# Altium schematic sheet Battery_Operated Node.SchDoc: Battery Oprated node
size OrCAD B; Date: 3/26/2015 6:39:54 PM; ApprovedBy: Approved By:; CheckedBy: Checked By:; Author: Auther:; CompanyName: Souliss; DrawnBy: Yoosof Piran; Engineer: Yoosof Piran; Revision: None; SheetNumber: 1; Design by:: Design by:Yoosof Piran; ProjectName: Battery Operated Nodes
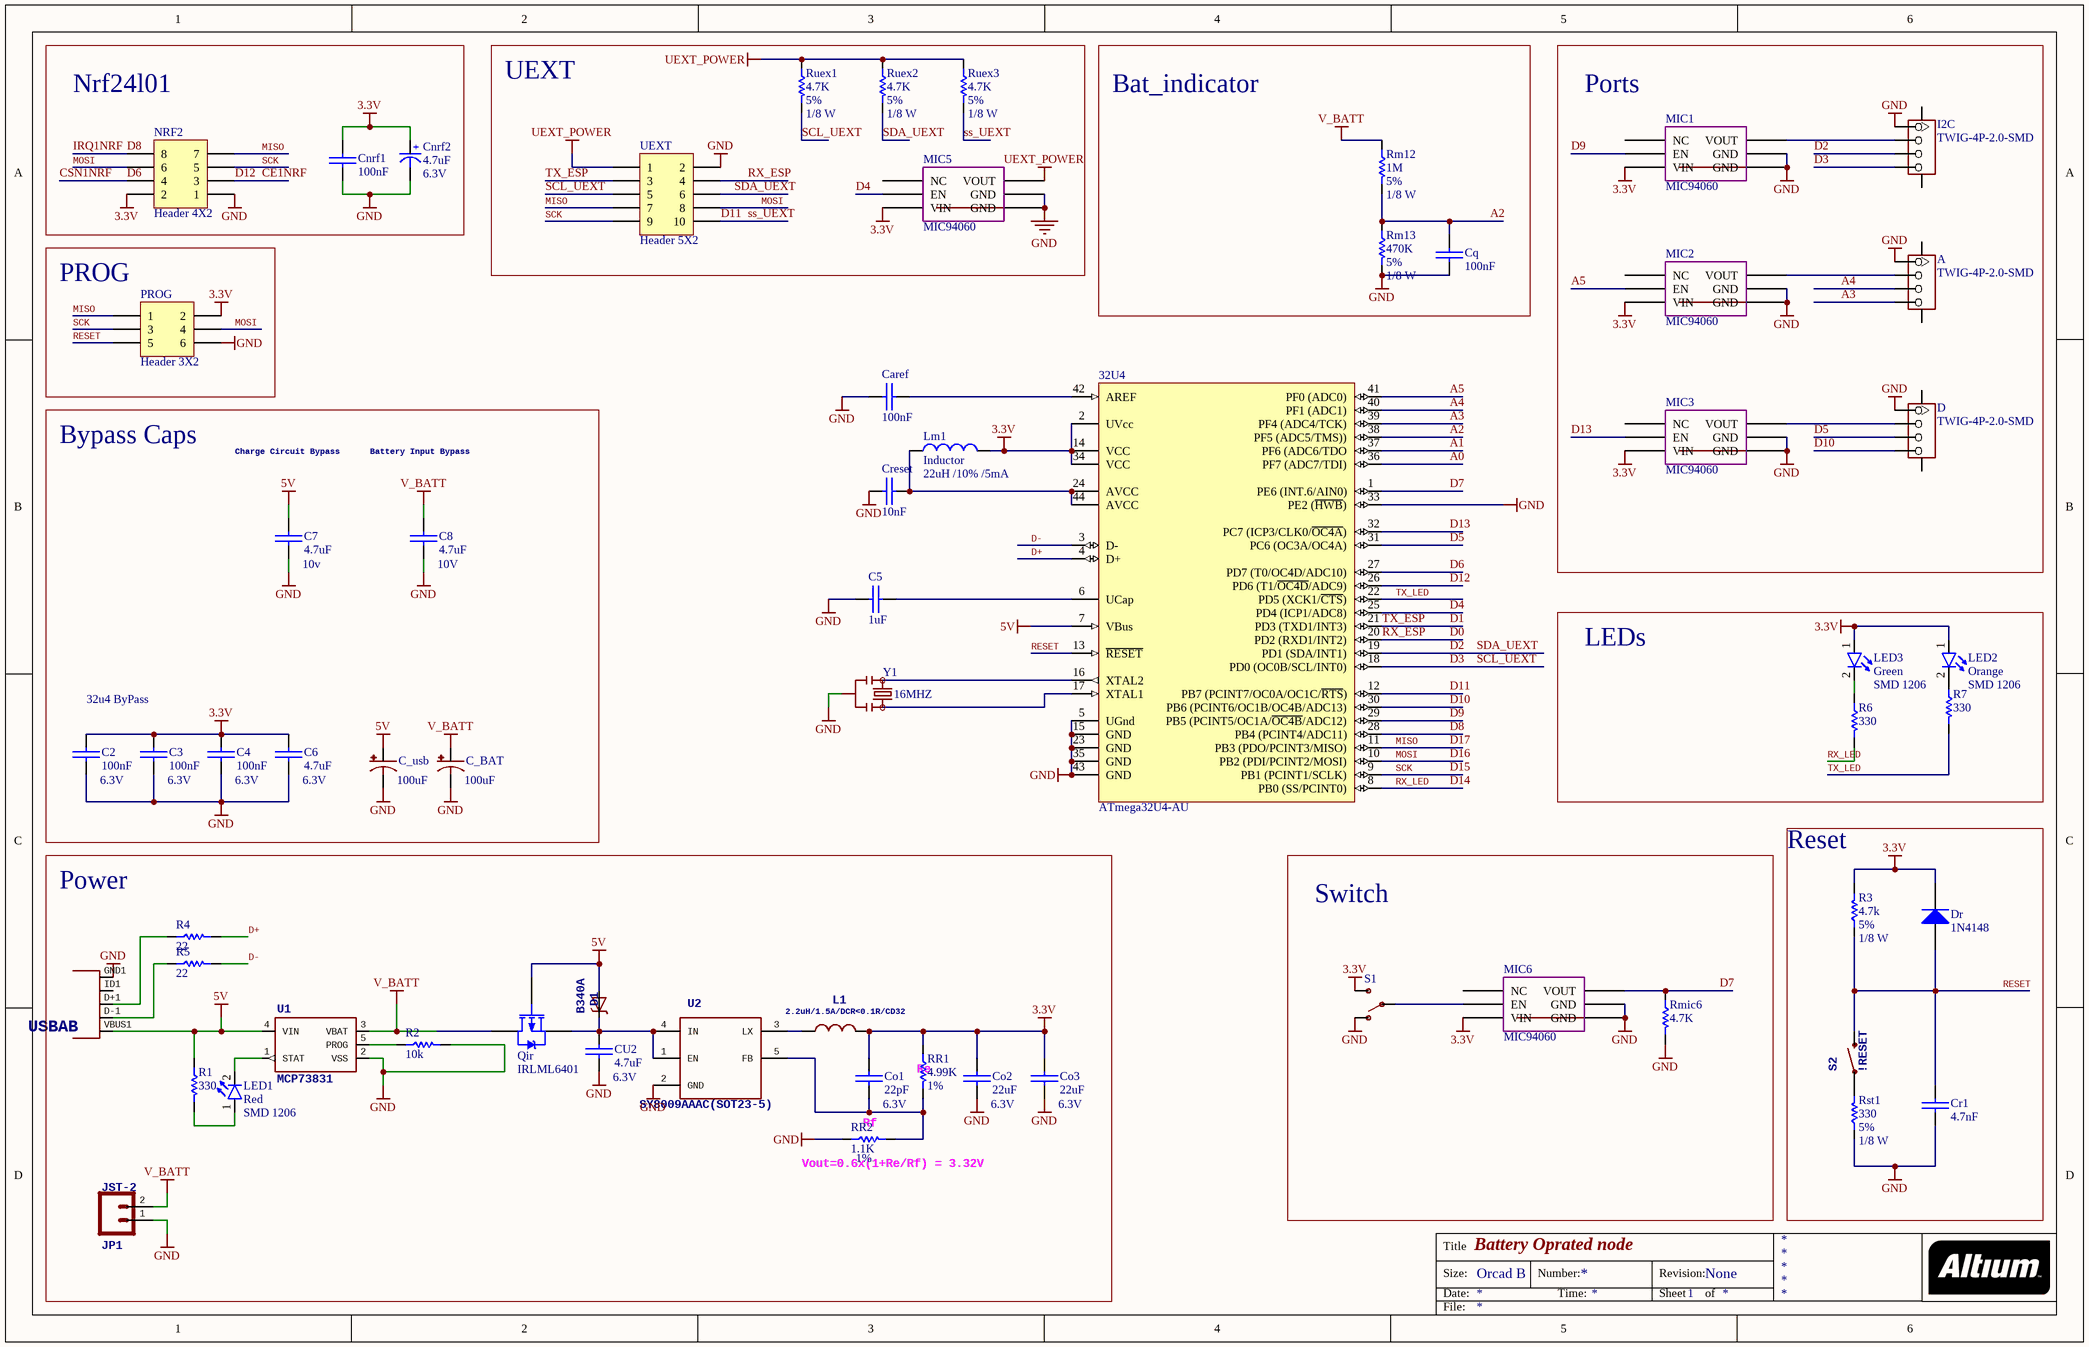
[diagram p0: Battery_Operated Node.SchDoc]

## Parts
32U4  ATmega32U4-AU  [44ML_N]
A  TWIG-4P-2.0-SMD  [4P-SMD-2.0]
C2  Voltage: 6.3V  [SMD_CAP_0805]  (hidden comment: 100nF)
C3  Voltage: 6.3V  [SMD_CAP_0805]  (hidden comment: 100nF)
C4  Voltage: 6.3V  [SMD_CAP_0805]  (hidden comment: 100nF)
C5  1uF  [SMD_CAP_0805]
C6  Voltage: 6.3V  [SMD_CAP_0805]  (hidden comment: 4.7uF)
C7  Voltage: 10v  [SMD_CAP_0805]  (hidden comment: 4.7uF)
C8  Voltage: 10V  [SMD_CAP_0805]  (hidden comment: 4.7uF)
C_BAT  value 100uF  [PANASONIC_D]  (hidden comment: Polar Capacitor 10V)
C_usb  value 100uF  [PANASONIC_D]  (hidden comment: Polar Capacitor 10V)
Caref  100nF  [SMD_CAP_0805]
Cnrf1  100nF  [SMD_CAP_0805]
Cnrf2  value 4.7uF  Voltage: 6.3V  [CAPP 1206 (3216X18L) Size A]  (hidden comment: 4.7uF 6.3V Tantalum)
Co1  Voltage: 6.3V  [SMD_CAP_0805]  (hidden comment: 22pF)
Co2  Voltage: 6.3V  [SMD_CAP_0805]  (hidden comment: 22uF)
Co3  Voltage: 6.3V  [SMD_CAP_0805]  (hidden comment: 22uF)
Cq  100nF  [SMD_CAP_0805]
Cr1  4.7nF  [SMD_CAP_0805]
Creset  10nF  [SMD_CAP_0805]
CU2  Voltage: 6.3V  [SMD_CAP_0805]  (hidden comment: 4.7uF)
D  TWIG-4P-2.0-SMD  [4P-SMD-2.0]
D1  B340A  [SMA-DIODE]
Dr  1N4148  [LL4148]
I2C  TWIG-4P-2.0-SMD  [4P-SMD-2.0]
JP1  JST-2  [JST-2-SMD]
L1  2.2uH/1.5A/DCR<0.1R/CD32  [CD32]
LED1  Size: SMD 1206  [LED SMD 1206]  (hidden comment: Red)
LED2  Size: SMD 1206  [LED SMD 1206]  (hidden comment: Orange)
LED3  Size: SMD 1206  [LED SMD 1206]  (hidden comment: Green)
Lm1  Inductor  value 22uH /10% /5mA  [INDC3216]
MIC1  MIC94060  [mic94060]
MIC2  MIC94060  [mic94060]
MIC3  MIC94060  [mic94060]
MIC5  MIC94060  [mic94060]
MIC6  MIC94060  [mic94060]
NRF2  Header 4X2  [HDR2X4]
PROG  Header 3X2  [HDR2X3]
Qir  IRLML6401  [Micro3_N]
R1  330  [RES 0805 (2012X06L)]
R2  10k  [RES 0805 (2012X06L)]
R3  Tolerance: 5%  Power: 1/8 W  [RES 0805 (2012X06L)]  (hidden comment: 4.7k)
R4  22  [RES 0805 (2012X06L)]
R5  22  [RES 0805 (2012X06L)]
R6  330  [RES 0805 (2012X06L)]
R7  330  [RES 0805 (2012X06L)]
Rm12  Tolerance: 5%  Power: 1/8 W  [RES 0805 (2012X06L)]  (hidden comment: 1M)
Rm13  Tolerance: 5%  Power: 1/8 W  [RES 0805 (2012X06L)]  (hidden comment: 470K)
Rmic6  4.7K  [RES 0805 (2012X06L)]
RR1  Tolerance: 1%  [RES 0805 (2012X06L)]  (hidden comment: 4.99K)
RR2  Tolerance: 1%  [RES 0805 (2012X06L)]  (hidden comment: 1.1K)
Rst1  Tolerance: 5%  Power: 1/8 W  [RES 0805 (2012X06L)]  (hidden comment: 330)
Ruex1  Tolerance: 5%  Power: 1/8 W  [RES 0805 (2012X06L)]  (hidden comment: 4.7K)
Ruex2  Tolerance: 5%  Power: 1/8 W  [RES 0805 (2012X06L)]  (hidden comment: 4.7K)
Ruex3  Tolerance: 5%  Power: 1/8 W  [RES 0805 (2012X06L)]  (hidden comment: 4.7K)
S1  (no value)  [SWITCH-SPDT-SMD]
S2  !RESET  [TACTILE_SWITCH_SMD]
U1  MCP73831  [SOT23-5]
U2  SY8009AAAC(SOT23-5)  [SOT23-5]
U5  USB AB Connector(micro usb)  [USB-AB-MICRO-SMD_V03]  (value not drawn)
UEXT  Header 5X2  [HDR2X5]
Y1  16MHZ  [RESONATOR-SMD]

## Blocks framed on the sheet
Nrf24l01: Cnrf1 Cnrf2 NRF2
UEXT: MIC5 Ruex1-Ruex3 UEXT
Bat_indicator: Cq Rm12 Rm13
Ports: A D I2C MIC1-MIC3
PROG: PROG
Bypass Caps: C2-C4 C6-C8 C_BAT C_usb
LEDs: LED2 LED3 R6 R7
Reset: Cr1 Dr R3 Rst1 S2
Power: Co1-Co3 CU2 D1 JP1 L1 LED1 Qir R1 R2 R4 R5 RR1 RR2 U1 U2 U5
Switch: MIC6 Rmic6 S1

## Nets
3.3V: 32U4.2(UVcc) 32U4.14(VCC) 32U4.34(VCC) C2.2(-) C3.2(-) C4.2(-) C6.2(-) Cnrf1.1(+) Cnrf2.1(+) Co1.2(-) Co2.2(-) Co3.2(-) Dr.2(K) L1.2 LED2.1(A) LED3.1(A) Lm1.2 MIC1.4(VIN) MIC2.4(VIN) MIC3.4(VIN) MIC5.4(VIN) MIC6.4(VIN) NRF2.2 PROG.2 R3.2 RR1.1 S1.3(S)
5V: 32U4.7(VBus) C7.2(-) C_usb.+ D1.A Qir.1(G) R1.1 U1.4(VIN) U5.VBUS1(VBUS)
GND: 32U4.5(UGnd) 32U4.15(GND) 32U4.23(GND) 32U4.33(PE2_(~{HWB})) 32U4.35(GND) 32U4.43(GND) A.1 C2.1(+) C3.1(+) C4.1(+) C5.1(+) C6.1(+) C7.1(+) C8.1(+) C_BAT.- C_usb.- Caref.1(+) Cnrf1.2(-) Cnrf2.2(-) Co2.1(+) Co3.1(+) Cq.2(-) Cr1.2(-) Creset.1(+) CU2.1(+) D.1 I2C.1 JP1.1 MIC1.2(GND) MIC1.5(GND) MIC2.2(GND) MIC2.5(GND) MIC3.2(GND) MIC3.5(GND) MIC5.2(GND) MIC5.5(GND) MIC6.2(GND) MIC6.5(GND) NRF2.1 PROG.6 R2.2 Rm13.2 Rmic6.2 RR2.1 Rst1.1 S1.1(O) U1.2(VSS) U2.2(GND) U5.GND1(GND) UEXT.2 Y1.2
UEXT_POWER: MIC5.1(VOUT) Ruex1.1 Ruex2.1 Ruex3.1 UEXT.1
V_BATT: C8.2(-) C_BAT.+ JP1.2 Qir.3(D) Rm12.1 U1.3(VBAT)
A0: 32U4.36(PF7_(ADC7/TDI))
A1: 32U4.37(PF6_(ADC6/TDO)
A2: 32U4.38(PF5_(ADC5/TMS))) Cq.1(+) Rm12.2 Rm13.1
A3: 32U4.39(PF4_(ADC4/TCK)) A.4
A4: 32U4.40(PF1_(ADC1)) A.3
A5: 32U4.41(PF0_(ADC0)) MIC2.3(EN)
CE1NRF: 32U4.26(PD6_(T1/~{OC4D}/ADC9)) NRF2.3  [also labelled D12]
CSN1NRF: 32U4.27(PD7_(T0/OC4D/ADC10)) NRF2.4  [also labelled D6]
D0: 32U4.20(PD2_(RXD1/INT2)) UEXT.4  [also labelled RX_ESP]
D1: 32U4.21(PD3_(TXD1/INT3)) UEXT.3  [also labelled TX_ESP]
D2: 32U4.19(PD1_(SDA/INT1)) I2C.3 Ruex2.2 UEXT.6  [also labelled SDA_UEXT]
D3: 32U4.18(PD0_(OC0B/SCL/INT0)) I2C.4 Ruex1.2 UEXT.5  [also labelled SCL_UEXT]
D4: 32U4.25(PD4_(ICP1/ADC8)) MIC5.3(EN)
D5: 32U4.31(PC6_(OC3A/OC4A)) D.3
D7: 32U4.1(PE6_(INT.6/AIN0)) MIC6.1(VOUT) Rmic6.1
D8: 32U4.28(PB4_(PCINT4/ADC11)) NRF2.8  [also labelled IRQ1NRF]
D9: 32U4.29(PB5_(PCINT5/OC1A/~{OC4B}/ADC12)) MIC1.3(EN)
D10: 32U4.30(PB6_(PCINT6/OC1B/OC4B/ADC13)) D.4
D11: 32U4.12(PB7_(PCINT7/OC0A/OC1C/~{RTS})) Ruex3.2 UEXT.10  [also labelled ss_UEXT]
D13: 32U4.32(PC7_(ICP3/CLK0/~{OC4A})) MIC3.3(EN)
D14: 32U4.8(PB0_(SS/PCINT0)) R6.2  [also labelled RX_LED]
D15: 32U4.9(PB1_(PCINT1/SCLK)) NRF2.5 PROG.3 UEXT.9  [also labelled SCK]
D16: 32U4.10(PB2_(PDI/PCINT2/MOSI)) NRF2.6 PROG.4 UEXT.8  [also labelled MOSI]
D17: 32U4.11(PB3_(PDO/PCINT3/MISO)) NRF2.7 PROG.1 UEXT.7  [also labelled MISO]
D+: 32U4.4(D+) R4.2
D-: 32U4.3(D-) R5.2
RESET: 32U4.13(~{RESET}) Cr1.1(+) Dr.1(A) PROG.5 R3.1 S2.3
TX_LED: 32U4.22(PD5_(XCK1/~{CTS})) R7.2
Net32U4_6: 32U4.6(UCap) C5.2(-)
Net32U4_16: 32U4.16(XTAL2) Y1.1
Net32U4_17: 32U4.17(XTAL1) Y1.3
Net32U4_24: 32U4.24(AVCC) 32U4.44(AVCC) Creset.2(-) Lm1.1
Net32U4_42: 32U4.42(AREF) Caref.2(-)
NetA_2: A.2 MIC2.1(VOUT)
NetCo1_1: Co1.1(+) RR1.2 RR2.2 U2.5(FB)
NetCU2_2: CU2.2(-) D1.C Qir.2(S) U2.1(EN) U2.4(IN)
NetD_2: D.2 MIC3.1(VOUT)
NetI2C_2: I2C.2 MIC1.1(VOUT)
NetL1_1: L1.1 U2.3(LX)
NetLED1_1: LED1.1(A) R1.2
NetLED1_2: LED1.2(K) U1.1(STAT)
NetLED2_2: LED2.2(K) R7.1
NetLED3_2: LED3.2(K) R6.1
NetMIC6_3: MIC6.3(EN) S1.2(P)
NetR2_1: R2.1 U1.5(PROG)
NetR4_1: R4.1 U5.D+1(D+)
NetR5_1: R5.1 U5.D-1(D-)
NetRst1_2: Rst1.2 S2.1

Not connected (* = marked no-connect by the designer): A SS1 SS2; D SS1 SS2; I2C SS1 SS2; MIC1 6(NC); MIC2 6(NC); MIC3 6(NC); MIC5 6(NC); MIC6 6(NC); U5 ID1(USBID)

## Notes on the sheet
- Charge Circuit Bypass
- Battery Input Bypass
- 32u4 ByPass
- (near RR1) Re
- (near RR2) Vout=0.6x(1+Re/Rf) = 3.32V
- (near RR2) Rf
- Title
- Size:
- Date:
- Orcad B
- Number:
- Time:
- Revision:
- Sheet
- of
- File:

## Library data of the parts
32U4 = ATmega32U4-AU: 8-bit AVR Microcontroller, 44-pin TQFP, Industrial Grade (-40°C to 85°C); Published: 1-Apr-2010; DatasheetVersion: revD, Jan-2009; PackageVersion: rev.G, Jul-2007; PackageReference: 44ML; Publisher: Altium Limited; PackageDescription: 44-Pin Plastic Thin Quad Flat Pack, 10 x 10 x 1.0 mm Body, 0.8 mm Pitch (TQFP); Supplier 1: Digi-Key; Supplier Part Number 1: ATMEGA32U4-AU-ND; Supplier 2: Farnell; Supplier Part Number 2: 1748525; Supplier 3: Mouser; Supplier Part Number 3: 556-ATMEGA32U4-AU; ComponentLink1Description: Manufacturer Link; ComponentLink1URL: http://www.atmel.com/products/avr/default.asp?; ComponentLink2Description: ATmega16U4/32U4 Datasheet; ComponentLink2URL: http://www.atmel.com/dyn/resources/prod_documents/doc7766.pdf; ComponentLink3Description: ATmega16U4 ATmega32U4 Summary; ComponentLink3URL: http://www.atmel.com/dyn/resources/prod_documents/7766S.pdf; ComponentLink4Description: Atmel.com Home; ComponentLink4URL: http://www.atmel.com
A D I2C = TWIG-4P-2.0-SMD-FEMALE-REINFORCE'DD': part num:1125S-SMT-4P URL: http://oom.lt/J204S
C2-C4 C6-C8 Co1-Co3 CU2 = Cap-Bipolar: ceramic capacitor
  C2-C4: Value: 100nF
  C6-C8 CU2: Value: 4.7uF
  Co1: Value: 22pF
  Co2 Co3: Value: 22uF
C5 Cq = Cap-Bipolar: ceramic capacitor; Voltage: 6.3V
  C5: Value: 1uF
  Cq: Value: 100nF
C_BAT C_usb = CAP_POLD
Caref Cnrf1 Cr1 Creset = Cap-Bipolar: ceramic capacitor; Voltage: 100V; Designer: Saeid Jorablo; Organazation: ControTec; Adding Date: 1387/12/20
  Caref Cnrf1: Value: 100nF
  Cr1: Value: 4.7nF
  Creset: Value: 10nF
Cnrf2 = Cap-Polar: Tantalum Capacitor Size A
D1 = DIODE-SCHOTTKY-B340A: Schottky diodes in SFE's production catalog<p> / BAT20J 1A 23V 0.62Vf<br> / RB751 120mA 40V 0.37Vf<br> / PMEG4005EJ 0.5A 40V 0.42Vf<br> / MBRA140 1A 40V 0.5Vf<br> / B340A  3A 40V SMA <br>
Dr = Diode 1N4148: High Conductance Fast Diode; Published: 8-Jun-2000; LatestRevisionDate: 17-Jul-2002; LatestRevisionNote: Re-released for DXP Platform.; DatasheetVersion: 1997; PackageReference: DO-35; Publisher: Altium Limited; PackageDescription: Diode, Axial; Body 3.8 x 1.9 mm (LxDia. max), Lead Dia. 0.53 mm (max); Code_JEDEC: DO-204-AH; ComponentLink1Description: Manufacturer Link; ComponentLink1URL: http://www.fairchildsemi.com/; ComponentLink2Description: Datasheet; ComponentLink2URL: http://www.fairchildsemi.com/ds/1N%2F1N4148.pdf
JP1 = M02-JST-2MM-SMT: Standard 2-pin 0.1" header. Use with <br> / - straight break away headers ( PRT-00116)<br> / - right angle break away headers (PRT-00553)<br> / - swiss pins (PRT-00743)<br> / - machine pins (PRT-00117)<br> / - female headers (PRT-00115)<br><br> / Molex polarized connector foot print use with: PRT-08233 with associated crimp pins and housings.<br><br> / 2.54_SCREWTERM for use with  PRT-10571.<br><br> / 3.5mm Screw Terminal footprints for  PRT-08084<br><br> / 5mm Screw Terminal footprints for use with PRT-08433; PROD_ID: CONN-08352
L1 = L-CD32
LED1-LED3 = LED: Designer: Saeid Jorablo; Organazation: ControTec; Adding Date: 1387/12/22
  LED1: Color: Red
  LED2: Color: Orange
  LED3: Color: Green
Lm1 = Inductor: Code_IEC: 1005; Published: 8-Jun-2000; LatestRevisionDate: 29-May-2009; LatestRevisionNote: IPC-7351 Footprint Added.; PackageReference: 0402-A; Publisher: Altium Limited; PackageDescription: Chip Inductor; Code_JEITA: 0402
MIC1-MIC3 MIC5 MIC6 = MIC94060: MIC94060YC6, SC-70-6
NRF2 = Header 4X2: Header, 4-Pin, Dual row; Revision: 17-Jul-2002: Re-released for DXP Platform.; Publisher: Altium Limited
PROG = Header 3X2: Header, 3-Pin, Dual row; Revision: 17-Jul-2002: Re-released for DXP Platform.; Publisher: Altium Limited
Qir = IRLML6401: HEXFET Power MOSFET; Published: 17-Sep-2003; DatasheetVersion: 2-Jul-2001; PackageVersion: Jul-2001; PackageReference: Micro3; Publisher: Altium Limited; PackageDescription: 3-Pin SOT-23 Package 0.95 mm Pitch, 2.3 mm Lead Span; ComponentLink1Description: Manufacturer Link; ComponentLink1URL: http://www.irf.com/; ComponentLink2Description: Datasheet; ComponentLink2URL: http://www.irf.com/product-info/datasheets/data/IRLML6401.pdf
R1 R2 R4-R7 Rmic6 = Resistor: Tolerance: 5%; Power: 1/8 W
  R1 R6 R7: Value: 330
  R2: Value: 10k
  R4 R5: Value: 22
  Rmic6: Value: 4.7K
R3 Rm12 Rm13 Rst1 Ruex1-Ruex3 = Resistor
  R3: Value: 4.7k
  Rm12: Value: 1M
  Rm13: Value: 470K
  Rst1: Value: 330
  Ruex1-Ruex3: Value: 4.7K
RR1 RR2 = Resistor: Power: 1/8 W
  RR1: Value: 4.99K
  RR2: Value: 1.1K
S1 = SWITCH-SPDTSMD2: part num:AYZ0102AGRLC or JS102011SAQN
S2 = SWITCH-MOMENTARY-2SMD: Various NO switches- part num:TS-1518S
U1 = MCP73831: Miniature single cell, fully integrated Li-Ion, Li-polymer charge management controller<br> / http://ww1.microchip.com/downloads/en/DeviceDoc/21984a.pdf<br> / IC-09995; PROD_ID: IC-09995
U2 = SY8008
U5 = USB-ABCONN-11794: part num:1125S-SMT-4P; PROD_ID: CONN-11794; USBAB: USBAB
UEXT = Header 5X2: Header, 5-Pin, Dual row; Revision: 17-Jul-2002: Re-released for DXP Platform.; Publisher: Altium Limited
Y1 = RESONATOR8MHZ: Resonator ,Small SMD resonator,Used, eg, on the Arduino Pro/ Pro Mini boards.  16MHz- XTAL-08895; PROD_ID: XTAL-08895